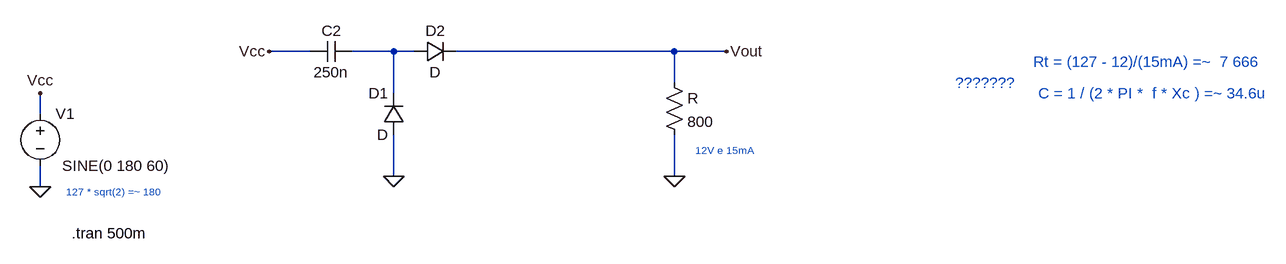
[diagram p0: schematic Draft1.asc]
Draft1.asc, the LTspice schematic file:
Version 4
SHEET 1 1576 680
WIRE 48 144 -16 144
WIRE 176 144 112 144
WIRE 208 144 176 144
WIRE 608 144 272 144
WIRE 688 144 608 144
WIRE 608 192 608 144
WIRE 176 208 176 144
WIRE -368 240 -368 208
WIRE 176 336 176 272
WIRE 608 336 608 272
WIRE -368 352 -368 320
FLAG 688 144 Vout
FLAG -16 144 Vcc
FLAG -368 352 0
FLAG -368 208 Vcc
FLAG 608 336 0
FLAG 176 336 0
SYMBOL voltage -368 224 R0
WINDOW 123 0 0 Left 0
WINDOW 39 0 0 Left 0
WINDOW 3 34 96 Left 2
SYMATTR Value SINE(0 180 60)
SYMATTR InstName V1
SYMBOL res 592 176 R0
SYMATTR InstName R
SYMATTR Value 800
SYMBOL diode 208 160 R270
WINDOW 0 32 32 VTop 2
WINDOW 3 0 32 VBottom 2
SYMATTR InstName D2
SYMBOL cap 112 128 R90
WINDOW 0 0 32 VBottom 2
WINDOW 3 32 32 VTop 2
SYMATTR InstName C2
SYMATTR Value 250n
SYMBOL diode 192 272 R180
WINDOW 0 24 64 Left 2
WINDOW 3 24 0 Left 2
SYMATTR InstName D1
TEXT -320 424 Left 2 !.tran 500m
TEXT -328 360 Left 1 ;127 * sqrt(2) =~ 180
TEXT 640 296 Left 1 ;12V e 15mA
TEXT 1160 160 Left 2 ;Rt = (127 - 12)/(15mA) =~  7 666
TEXT 1168 208 Left 2 ;C = 1 / (2 * PI *  f * Xc ) =~ 34.6u
TEXT 1040 192 Left 2 ;???????

The netlist it stands for:
* Draft1.asc
V1 Vcc 0 SINE(0 180 60)
R Vout 0 800
D2 N001 Vout D
C2 N001 Vcc 250n
D1 0 N001 D
.model D D
.lib standard.dio
.tran 500m
* 127 * sqrt(2) =~ 180
* 12V e 15mA
* Rt = (127 - 12)/(15mA) =~  7 666
* C = 1 / (2 * PI *  f * Xc ) =~ 34.6u
* ???????
.backanno
.end